# EAGLE schematic cgs_simple_wave_folder (EAGLE 7.1.0)
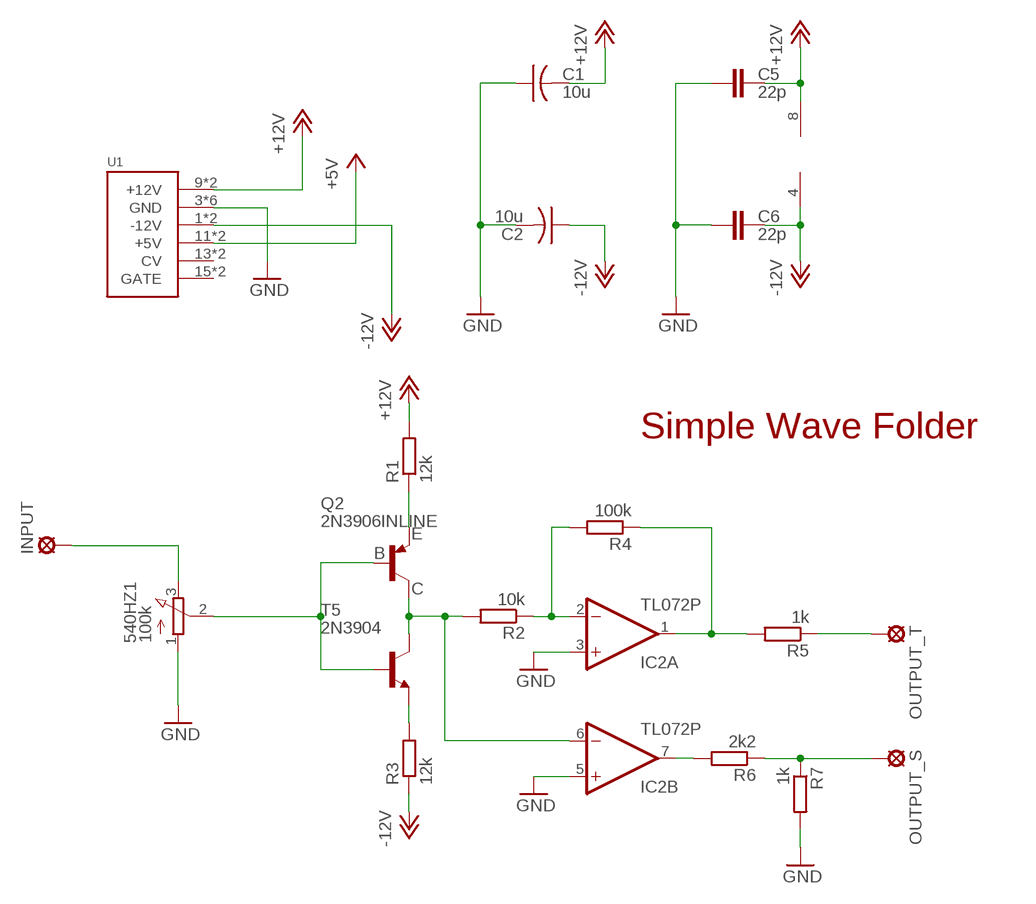
[diagram p0: schematic, sheet 1]

## Parts
540HZ1  100k  3RP/1610N  [3RP/1610N]
C1  10u  C-US025-050X050  [C025-050X050]
C2  10u  C-US025-050X050  [C025-050X050]
C5  22p  C-EU025-025X050  [C025-025X050]
C6  22p  C-EU025-025X050  [C025-025X050]
IC2  TL072P  [DIL08]
INPUT  LSP11  [LSP11]
OUTPUT_S  LSP11  [LSP11]
OUTPUT_T  LSP11  [LSP11]
Q2  2N3906INLINE  [TO92-CBE]
R1  12k  R-EU_0207/5V  [0207/5V]
R2  10k  R-EU_0207/5V  [0207/5V]
R3  12k  R-EU_0207/5V  [0207/5V]
R4  100k  R-EU_0207/5V  [0207/5V]
R5  1k  R-EU_0207/5V  [0207/5V]
R6  2k2  R-EU_0207/5V  [0207/5V]
R7  1k  R-EU_0207/5V  [0207/5V]
T5  2N3904  [TO92]
U1  POWER  [POWER_16]

## Nets
+5V: U1.11(+5V) U1.12(+5V)
+12V [Power]: C1.2 C5.2 IC2.8(P:V+) R1.2 U1.9(+12V) U1.10(+12V)
-12V: C2.1 C6.2 IC2.4(P:V-) R3.1 U1.1(-12V) U1.2(-12V)
GND [GND]: 540HZ1.1(A) C1.1 C2.2 C5.1 C6.1 IC2.3(A:+IN) IC2.5(B:+IN) R7.2 U1.3(GND) U1.4(GND) U1.5(GND) U1.6(GND) U1.7(GND) U1.8(GND)
N$1: 540HZ1.3(E) INPUT.MP
N$2: 540HZ1.2(S) Q2.B T5.2(B)
N$3: Q2.E R1.1
N$4: R3.2 T5.3(E)
N$5: IC2.2(A:-IN) R2.1 R4.2
N$6: IC2.6(B:-IN) Q2.C R2.2 T5.1(C)
N$7: IC2.1(A:OUT) R4.1 R5.2
N$8: OUTPUT_T.MP R5.1
N$9: IC2.7(B:OUT) R6.2
N$10: OUTPUT_S.MP R6.1 R7.1
Unconnected: U1.13(CV) U1.14(CV) U1.15(GATE) U1.16(GATE)

## Notes on the sheet
- Simple Wave Folder

## Library data of the parts
540HZ1 = pot:3RP/1610N: 16mm Potentiometer one level Source: http://www.alphapotentiometers.net/html/16mm_pot_2.html
C1 C2 = rcl:C-US: CAPACITOR, American symbol
C5 C6 = TR808clone:C-EU: CAPACITOR, European symbol Pitch 3mm
IC2 = linear:TL072: OP AMP
INPUT OUTPUT_S OUTPUT_T = solpad:LSP11: SOLDER PAD drill 1.1 mm
Q2 = bt_transistor:2N3906: PNP Transistor Small signal PNP Bipolar Junction Transistor (BJT). Use this device to represent any of a number of such transistors with similar package and pinout: 2N4402, 2N3906, etc.
R1-R7 = TR808clone:R-EU_: RESISTOR, European symbol
T5 = transistor:2N3904: NPN TRANSISTOR
U1 = eurorack:POWER

## Net classes
1 GND: width 1.016 mm, drill 1.016 mm, clearance 0.508 mm
2 Power: width 1.016 mm, drill 1.016 mm, clearance 0.508 mm
3 special: width 0.635 mm, drill 0.254 mm, clearance 0.254 mm
4 15v: width 1.524 mm, drill 1.016 mm, clearance 0.508 mm